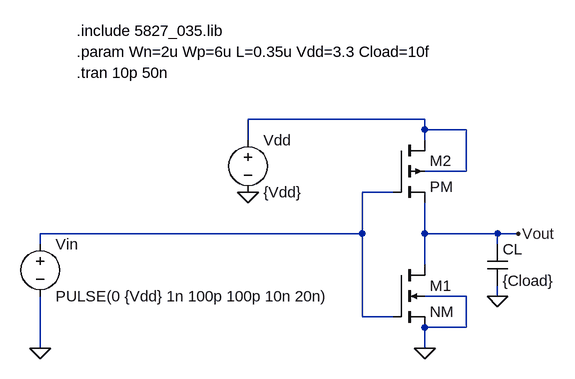
[diagram p0: schematic TP.asc]
TP.asc, the LTspice schematic file:
Version 4
SHEET 1 1304 680
WIRE 352 -160 80 -160
WIRE 352 -144 352 -160
WIRE 416 -144 352 -144
WIRE 80 -128 80 -160
WIRE 352 -128 352 -144
WIRE 416 -80 416 -144
WIRE 416 -80 352 -80
WIRE 304 -48 256 -48
WIRE 256 16 256 -48
WIRE 256 16 -240 16
WIRE 352 16 352 -32
WIRE 464 16 352 16
WIRE 496 16 464 16
WIRE -240 32 -240 16
WIRE 464 32 464 16
WIRE 352 64 352 16
WIRE 416 112 352 112
WIRE 464 112 464 96
WIRE 256 144 256 16
WIRE 304 144 256 144
WIRE 416 160 416 112
WIRE 416 160 352 160
WIRE -240 192 -240 112
WIRE 352 192 352 160
FLAG 80 -48 0
FLAG 496 16 Vout
FLAG 352 192 0
FLAG -240 192 0
FLAG 464 112 0
SYMBOL pmos4 304 -128 R0
SYMATTR InstName M2
SYMATTR Value PM
SYMATTR SpiceLine W={Wp} L={L}
SYMBOL nmos4 304 64 R0
SYMATTR InstName M1
SYMATTR Value NM
SYMATTR SpiceLine W={Wn} L={L}
SYMBOL voltage 80 -144 R0
WINDOW 123 0 0 Left 0
WINDOW 39 0 0 Left 0
SYMATTR InstName Vdd
SYMATTR Value {Vdd}
SYMBOL voltage -240 16 R0
WINDOW 123 0 0 Left 0
WINDOW 39 0 0 Left 0
SYMATTR InstName Vin
SYMATTR Value PULSE(0 {Vdd} 1n 100p 100p 10n 20n)
SYMBOL cap 448 32 R0
SYMATTR InstName CL
SYMATTR Value {Cload}
TEXT -184 -296 Left 2 !.include 5827_035.lib
TEXT -184 -264 Left 2 !.param Wn=2u Wp=6u L=0.35u Vdd=3.3 Cload=10f
TEXT -184 -232 Left 2 !.tran 10p 50n

The netlist it stands for:
* TP.asc
M2 N001 N002 Vout N001 PM W={Wp} L={L}
M1 Vout N002 0 0 NM W={Wn} L={L}
Vdd N001 0 {Vdd}
Vin N002 0 PULSE(0 {Vdd} 1n 100p 100p 10n 20n)
CL Vout 0 {Cload}
.model NMOS NMOS
.model PMOS PMOS
.lib standard.mos
.include 5827_035.lib
.param Wn=2u Wp=6u L=0.35u Vdd=3.3 Cload=10f
.tran 10p 50n
.backanno
.end